# EAGLE design Practica1.v2 (EAGLE 7.7.0)
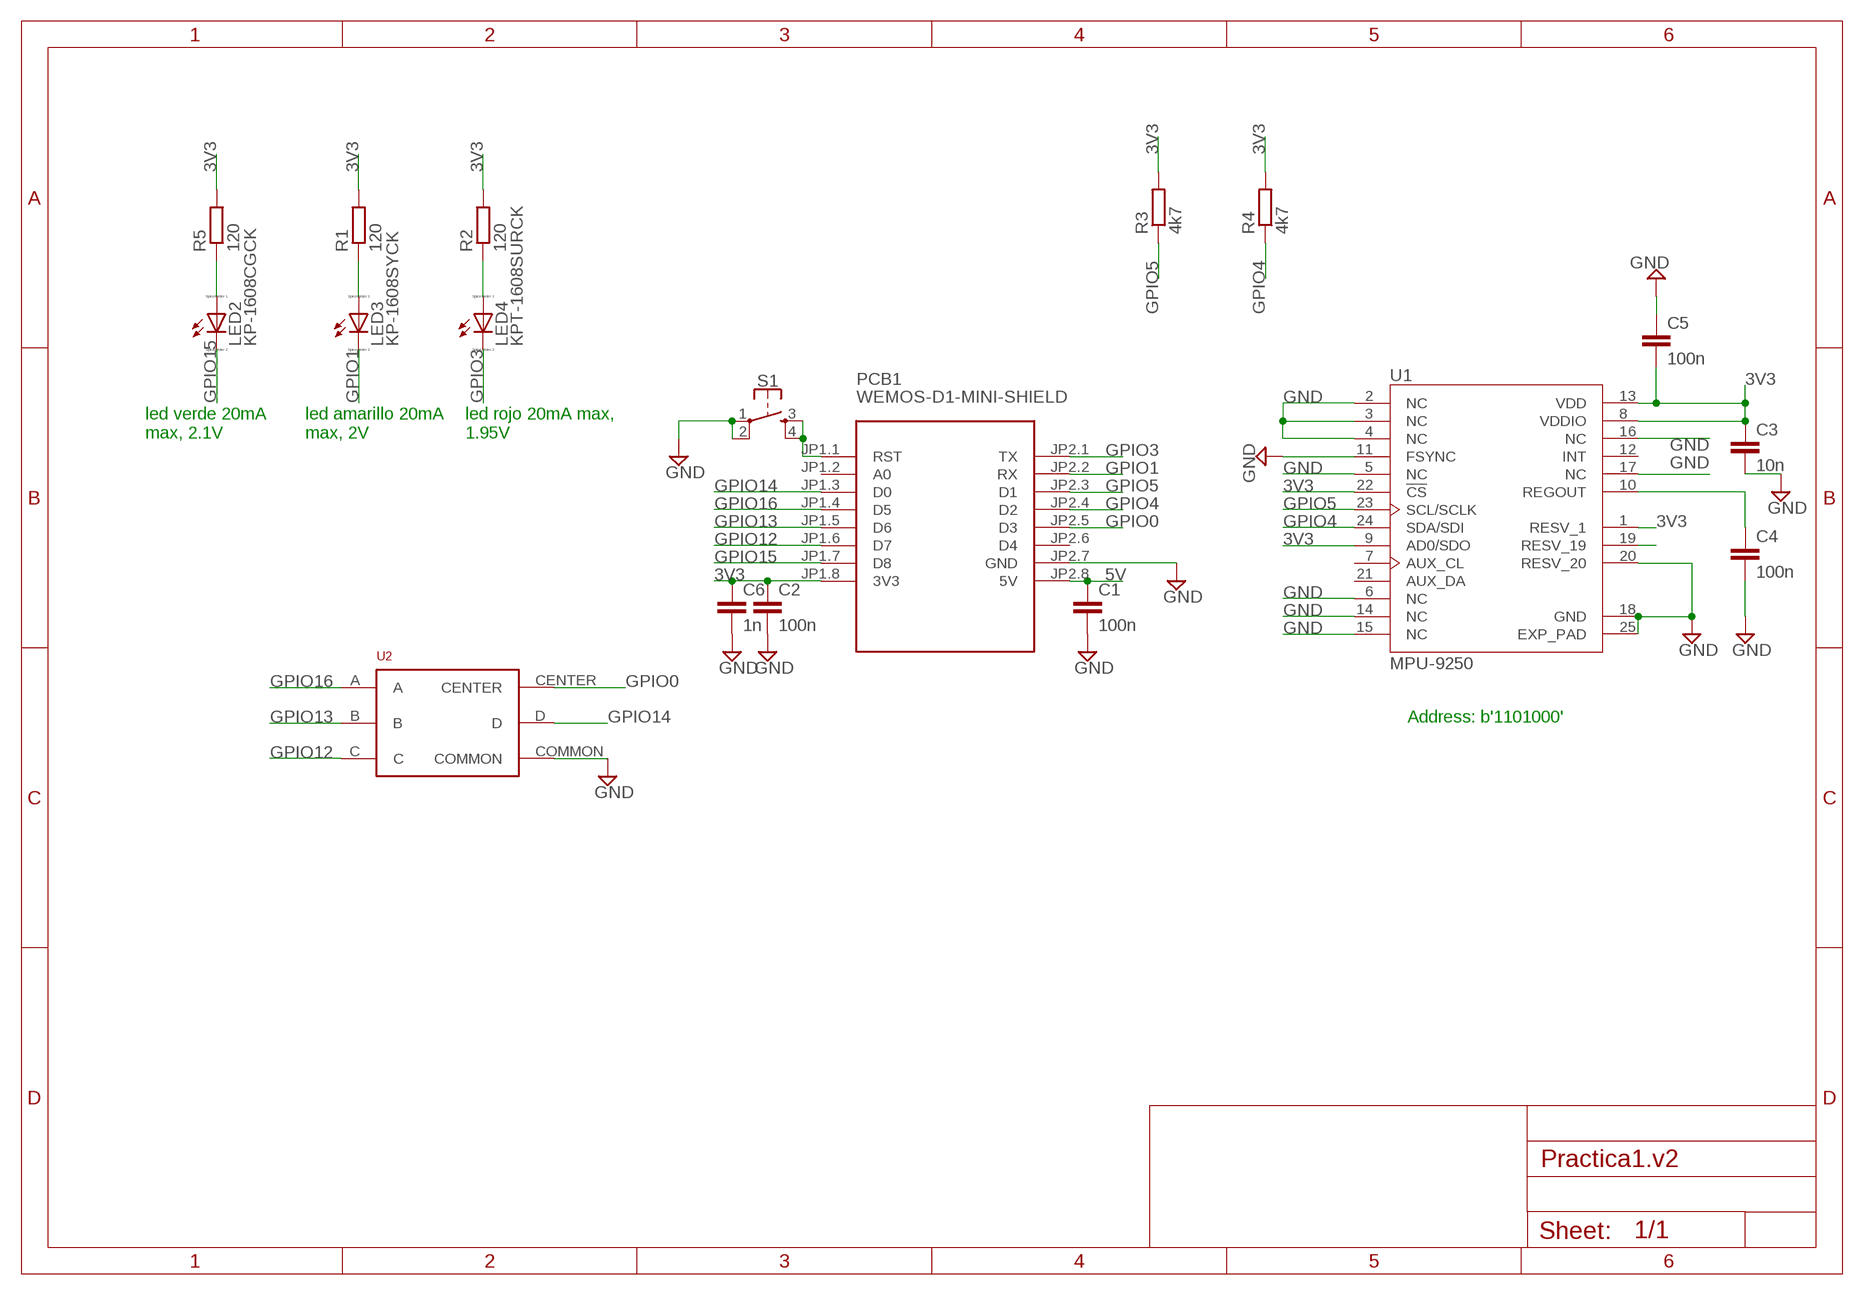
[diagram p0: schematic, sheet 1]

## Parts
C1  100n  C-EUC0805  [C0805]
C2  100n  C-EUC0805  [C0805]
C3  10n  C-EUC0603  [C0603]
C4  100n  C-EUC0805  [C0805]
C5  100n  C-EUC0805  [C0805]
C6  1n  C-EUC0402  [C0402]
LED2  KP-1608CGCK  LED_ESML0603  [LED_SML0603]
LED3  KP-1608SYCK  LED_ESML0603  [LED_SML0603]
LED4  KPT-1608SURCK  LED_ESML0603  [LED_SML0603]
PCB1  WEMOS-D1-MINI-SHIELD  [WEMOS-D1-MINI-SHIELD]
R1  120  R-EU_R1206  [R1206]
R2  120  R-EU_R1206  [R1206]
R3  4k7  R-EU_R1206  [R1206]
R4  4k7  R-EU_R1206  [R1206]
R5  120  R-EU_R1206  [R1206]
S1  MOMENTARY-SWITCH-SPST-2-SMD-5.2MM-TALL  [TACTILE_SWITCH_SMD_5.2MM]
U1  MPU-9250  [QFN40P300X300X105-25N]
U2  JOYSTICK  [JOYSTICK_516_316]

## Nets
3V3: C2.1 C3.1 C5.2 C6.1 PCB1.JP1.8(3V3) R1.2 R2.2 R3.2 R4.2 R5.2 U1.1(RESV_1) U1.8(VDDIO) U1.9(AD0/SDO) U1.13(VDD) U1.22(!CS)
5V: C1.1 PCB1.JP2.8(5V)
FEGDC: LED2.A R5.1
GND: C1.2 C2.2 C3.2 C4.2 C5.1 C6.2 PCB1.JP2.7(GND) S1.1 S1.2 U1.2(NC) U1.3(NC) U1.4(NC) U1.5(NC) U1.6(NC) U1.11(FSYNC) U1.14(NC) U1.15(NC) U1.16(NC) U1.17(NC) U1.18(GND) U1.20(RESV_20) U1.25(EXP_PAD) U2.COMMON
GPIO0: PCB1.JP2.5(D3) U2.CENTER
GPIO1: LED3.C PCB1.JP2.2(RX)
GPIO3: LED4.C PCB1.JP2.1(TX)
GPIO4: PCB1.JP2.4(D2) R4.1 U1.24(SDA/SDI)
GPIO5: PCB1.JP2.3(D1) R3.1 U1.23(SCL/SCLK)
GPIO12: PCB1.JP1.6(D7) U2.C
GPIO13: PCB1.JP1.5(D6) U2.B
GPIO14: PCB1.JP1.3(D0) U2.D
GPIO15: LED2.C PCB1.JP1.7(D8)
GPIO16: PCB1.JP1.4(D5) U2.A
N$1: PCB1.JP1.1(RST) S1.3 S1.4
N$2: LED3.A R1.1
N$3: LED4.A R2.1
N$4: U1.19(RESV_19)
N$5: C4.1 U1.10(REGOUT)
Unconnected: PCB1.JP1.2(A0) PCB1.JP2.6(D4) U1.7(AUX_CL) U1.12(INT) U1.21(AUX_DA)

## Notes on the sheet
- led verde 20mA 
  max, 2.1V
- led amarillo 20mA 
  max, 2V
- led rojo 20mA max, 
  1.95V
- Address: b'1101000'

## Library data of the parts
C1-C6 = resistor:C-EU: CAPACITOR, European symbol
LED2-LED4 = eagle-ltspice:LED_E: LED Source: http://www.osram.convergy.de Source: www.luxeon.com Source: www.kingbright.com; SPICEMODEL: NONE; SPICEPREFIX: D; SPICETYPE: diode
PCB1 = Shield:WEMOS-D1-MINI-SHIELD: Template for WEMOS D1 mini compatible shields NOTICE: This is a template only. You can use it as a base to create symbols for WEMOS D1 mini compatible shields. Official list of available shields can be found here: https://www.wemos.cc/D1-mini-Shields
R1-R5 = rcl:R-EU_: RESISTOR, European symbol; SPICEPREFIX: R
S1 = SparkFun-Switches:MOMENTARY-SWITCH-SPST-2: Momentary Switch (Pushbutton) - SPST - Two Circuits Normally-open (NO) SPST momentary switches (buttons, pushbuttons). Schematic symbol includes two switch circuits. Variants SMD-4.6MMX2.8MM - 4.60mm x 2.80mm Tactile Momentary Button Switch - Used on SparkFun SAMD21 Mini Breakout <https://www.sparkfun.com/products/13664> SMD-5.2MM - Mini Pushbutton Switch - SMD <https://www.sparkfun.com/products/8720> - Used on Arduino Pro Mini <https://www.sparkfun.com/products/11114>; PROD_ID: SWCH-14139
U1 = MPU-9250:MPU-9250: MPU-9250 Sensor, 9-axis, I2C, SPI Manufacturer: TDK Invensense Part number: MPU-9250 Distributor: RS Components Code: 883-7942 Mounting: SMD Pins: 24 pins Datasheet <http://www.invensense.com/wp-content/uploads/2015/02/PS-MPU-9250A-01-v1.1.pdf> Website: RS <https://es.rs-online.com/web/p/sensores-de-acelerometro/8837942/>; DESCRIPTION: SMD Gyroscope/Accelerometer/Magnetometer Sensor; 9-AXIS; MANUFACTURER: TDK InvenSense; PARTNUMBER: MPU-9250
U2 = joystick:JOYSTICK: JOYSTICK 2-axis joystick Manufacturer: Alps Part number: SKQUCAA010 Distributor: RS Components Code: 516-316 Mounting: SMD Pins: 6 pins Datasheet <https://docs-emea.rs-online.com/webdocs/0bf3/0900766b80bf370e.pdf> Website: RS <https://it.rs-online.com/web/p/interruttori-joystick/0516316/>; DESCRIPTION: 2-axis joystick; DISTRCODE: 516-316; DISTRIBUTOR: RS; MANUFACTURER: Alps; PARTNUMBER: SKQUCAA010

## Board
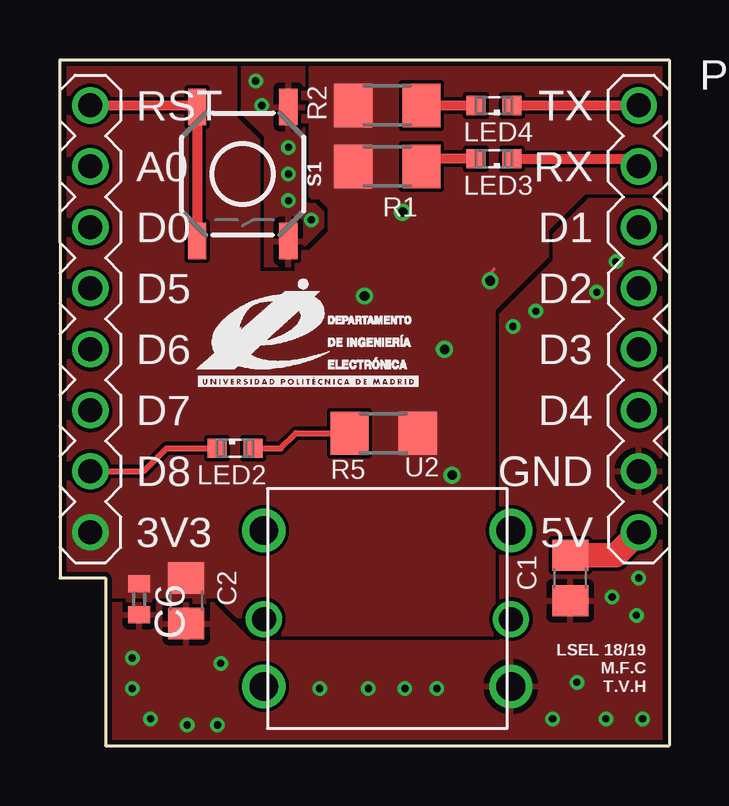
[diagram p1: board, top side]
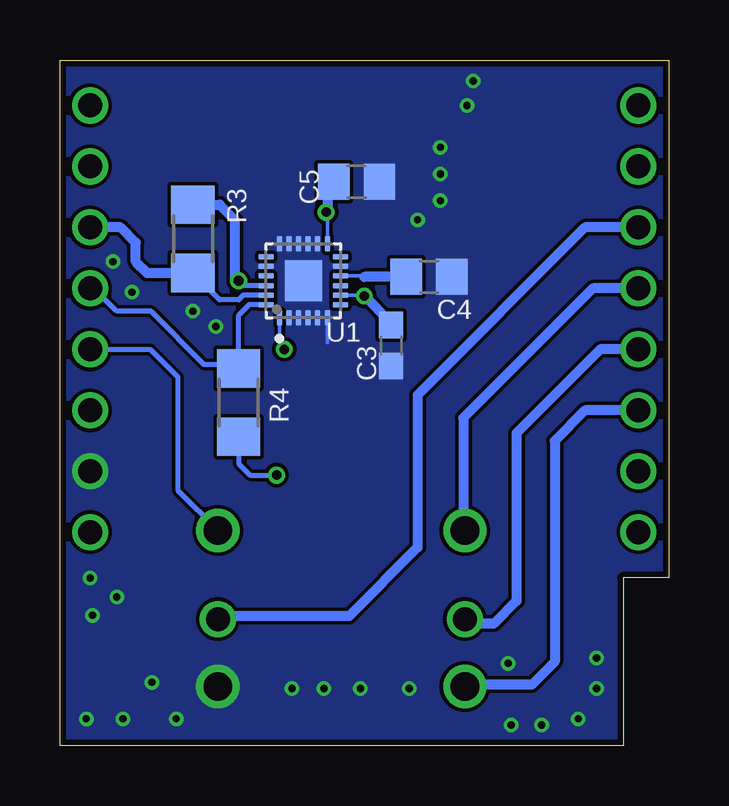
[diagram p2: board, bottom side, seen from below]

Size 25.39 x 28.57 mm. Coordinates in mm from the lower left corner, seen from the top.
Outline: 0,6.99 1.91,6.99 1.91,0 25.39,0 25.39,28.57 0,28.57 0,6.99
Copper layers (1*16): Top 0.035mm / dielectric 1.5mm / Bottom 0.035mm
Design rules "SeeedStudio_2layer_DRU_no_angle_20140221 *": minimum track width 6mil, minimum drill 10mil, track to track 6mil, track to pad 6mil, pad to pad 6mil, via to via 6mil, smd to smd 0mil, copper to edge 10mil, drill to drill 10mil, minimum pad ring 10mil, minimum via ring 6mil, stop-mask expansion 2mil, vias tented up to drill 100mil, thermal gap 10mil

### Footprints (pad centres in the part's own frame; a part is rotated, then mirrored left to right if it is on the bottom)
C0805 = smd 1.3 x 1.5: 1 -0.95,0; 2 0.95,0
C0603 = smd 1.1 x 1: 1 -0.85,0; 2 0.85,0
C0402 = smd 0.7 x 0.9: 1 -0.65,0; 2 0.65,0
LED_SML0603 = smd 0.8 x 0.8: A 0.75,0; C -0.75,0
WEMOS-D1-MINI-SHIELD = drill 1: JP1.1 -11.43,12.065; JP1.2 -11.43,9.525; JP1.3 -11.43,6.985; JP1.4 -11.43,4.445; JP1.5 -11.43,1.905; JP1.6 -11.43,-0.635; JP1.7 -11.43,-3.175; JP1.8 -11.43,-5.715; JP2.1 11.43,12.065; JP2.2 11.43,9.525; JP2.3 11.43,6.985; JP2.4 11.43,4.445; JP2.5 11.43,1.905; JP2.6 11.43,-0.635; JP2.7 11.43,-3.175; JP2.8 11.43,-5.715
R1206 = smd 1.6 x 1.803: 1 -1.422,0; 2 1.422,0
TACTILE_SWITCH_SMD_5.2MM = smd 1.524 x 0.762: 1 -2.794,1.905; 2 2.794,1.905; 3 -2.794,-1.905; 4 2.794,-1.905
QFN40P300X300X105-25N = smd 0.64 x 0.22: 1 -1.545,1; 2 -1.545,0.6; 3 -1.545,0.2; 4 -1.545,-0.2; 5 -1.545,-0.6; 6 -1.545,-1; 13 1.545,-1; 14 1.545,-0.6; 15 1.545,-0.2; 16 1.545,0.2; 17 1.545,0.6; 18 1.545,1 | smd 0.22 x 0.64: 7 -1,-1.545; 8 -0.6,-1.545; 9 -0.2,-1.545; 10 0.2,-1.545; 11 0.6,-1.545; 12 1,-1.545; 19 1,1.545; 20 0.6,1.545; 21 0.2,1.545; 22 -0.2,1.545; 23 -0.6,1.545; 24 -1,1.545 | smd 1.7 x 1.54: 25 0,0
JOYSTICK_516_316 = drill 1.2: A -5.15,3.25; C -5.15,-3.25; CENTER 5.15,3.25; COMMON 5.15,-3.25 | drill 1: B -5.15,-0.45; D 5.15,-0.45

### Placement (x,y rotation side)
C1  21.27,6.99 270 top
C2  5.27,6.03 270 top
C3  11.59,16.67 270 bottom
C4  10,19.53 0 bottom
C5  13.02,23.5 180 bottom
C6  3.3,6.1 270 top
LED2  7.3,12.38 0 top
LED3  18.1,24.45 180 top
LED4  18.1,26.67 180 top
PCB1  12.7,14.61 0 top
R1  13.65,24.13 180 top
R2  13.65,26.67 180 top
R3  19.84,21.11 90 bottom
R4  17.94,14.29 270 bottom
R5  13.49,13.02 0 top
S1  7.62,23.81 270 top
U1  15.24,19.37 90 bottom
U2  13.65,5.71 0 top
U$1  [DIE_UPM]  5.71,14.95 0 top

### Tracks (layer width: path | path; a pad name or v marks a point on that pad's centre or on a via)
3V3  (via drill 0.4)
  Top 0.152: v16.03,16.51 15.72,16.51 | v17.94,19.37 17.94,19.68 18.1,19.84
  Bottom 0.152: U1.9 U1.8 12.73,18.77 v12.7,18.73 | U1.1 16.24,16.72 v16.03,16.51 | 18.1,19.53 v17.94,19.37 | U1.13 14.24,22.18 v14.29,22.23 14.24,22.27
  Bottom 0.203: U1.22 17.74,19.17 v17.94,19.37 | R4.2 17.94,11.75 17.46,11.27 v16.35,11.27
  Bottom 0.406: C5.2 14.24,22.82 14.24,22.27 | R3.2 18.73,22.54 18.1,21.91 18.1,19.53 | C3.1 11.59,17.62 v12.7,18.73
  pour Top (rank 6, no thermals): -1.27,-1.59 27.62,-1.59 29.53,0.32 29.53,29.53 26.67,32.38 -1.91,32.38 -4.76,29.53 -4.76,1.91
5V
  Top 1.016: PCB1.JP2.8 23.18,7.93 C1.1
FEGDC
  Top 0.254: LED2.A 9.21,12.38 9.84,13.02 R5.1
GND  (via drill 0.3)
  Bottom 0.152: U1.6 14.24,16.78
  other vias: 8.41,26.67 9.53,24.92 9.53,23.81 9.53,22.7 10.48,21.91 6.7,3.43 12.86,2.38 24.13,6.99 23.02,6.19 15.72,2.38 18.89,17.46 19.84,18.1 22.38,18.89 23.18,20.16 3.02,3.65 3.02,2.38 3.78,1.11 6.57,0.86 5.3,0.86 20.54,1.11 21.56,2.64 24.03,5.43 22.76,1.11 24.29,1.11 10.83,2.38 14.38,2.38 8.16,27.69
  pour Bottom (no thermals): -1.27,-0.95 27.62,-0.95 28.89,0.32 28.89,29.84 26.04,32.7 -2.86,32.7 -4.45,31.11 -4.45,2.22
  pour Top: -2.23,5.9 6.35,5.87 7.94,4.29 20.32,4.29 21.27,5.24 29.05,5.24 29.84,4.45 29.84,-1.59 29.69,-1.75 -1.11,-1.75 -2.22,-0.64 -2.22,5.08 -2.23,5.26
  pour Top: 7.62,28.89 7.62,26.35 8.57,25.4 8.57,20 9.68,20 9.68,20.32 10.95,21.59 10.95,22.23 10.64,22.54 10.32,22.54 10.16,22.7 10.16,29.21 9.53,29.84 8.57,29.84
  pour Top: 18.41,2.86 18.89,2.38 26.99,2.38 26.83,2.54 26.83,22.7 22.07,22.7 20.64,21.27 20.64,20.16 18.41,17.94
GPIO0
  Bottom 0.203: PCB1.JP2.5 21.62,16.51 20.48,15.37 20.48,10.64 U2.CENTER
GPIO1
  Top 0.406: LED3.C 23.81,24.45 PCB1.JP2.2
GPIO3
  Top 0.406: LED4.C PCB1.JP2.1
GPIO4
  Bottom 0.203: U1.24 17.5,18.37 17.93,17.94 17.94,17.94 R4.1 | 23.97,19.05 23.02,18.1 21.59,18.1 19.37,15.88 18.1,15.88
  Bottom 0.254: 23.97,19.05 PCB1.JP2.4 | R4.1 18.1,15.88
GPIO5
  Bottom 0.203: U1.23 17.75,18.77 17.94,18.57 18.73,18.57 R3.1
  Bottom 0.406: R3.1 21.76,19.69 22.23,20.16 22.23,20.95 22.86,21.59 PCB1.JP2.3
GPIO12
  Bottom 0.406: PCB1.JP1.6 3.49,13.97 4.76,12.7 4.76,3.49 5.71,2.54 8.43,2.54 U2.C
GPIO13
  Bottom 0.406: PCB1.JP1.5 2.86,16.51 6.35,13.02 6.35,6.03 7.3,5.08 8.32,5.08 U2.B
GPIO14
  Bottom 0.406: PCB1.JP1.3 3.49,21.59 10.48,14.61 10.48,8.26 13.34,5.4 18.67,5.4 U2.D
GPIO15
  Top 0.254: PCB1.JP1.7 3.49,11.43 4.45,12.38 LED2.C
GPIO16
  Bottom 0.406: PCB1.JP1.4 3.17,19.05 8.57,13.65 8.57,9.04 U2.A
N$1
  Top 0.406: PCB1.JP1.1 5.65,26.67 S1.3 S1.4
N$2
  Top 0.406: LED3.A 15.39,24.45 R1.1
N$3
  Top 0.406: R2.1 LED4.A
N$5
  Bottom 0.152: 10.99,19.57 C4.1 | U1.10 12.74,19.57 12.7,19.53
  Bottom 0.406: C4.1 12.7,19.53

### Text on the board
tNames: LSEL 18/19 / M.F.C / T.V.H